# EAGLE design untitled (EAGLE 7.4.0)
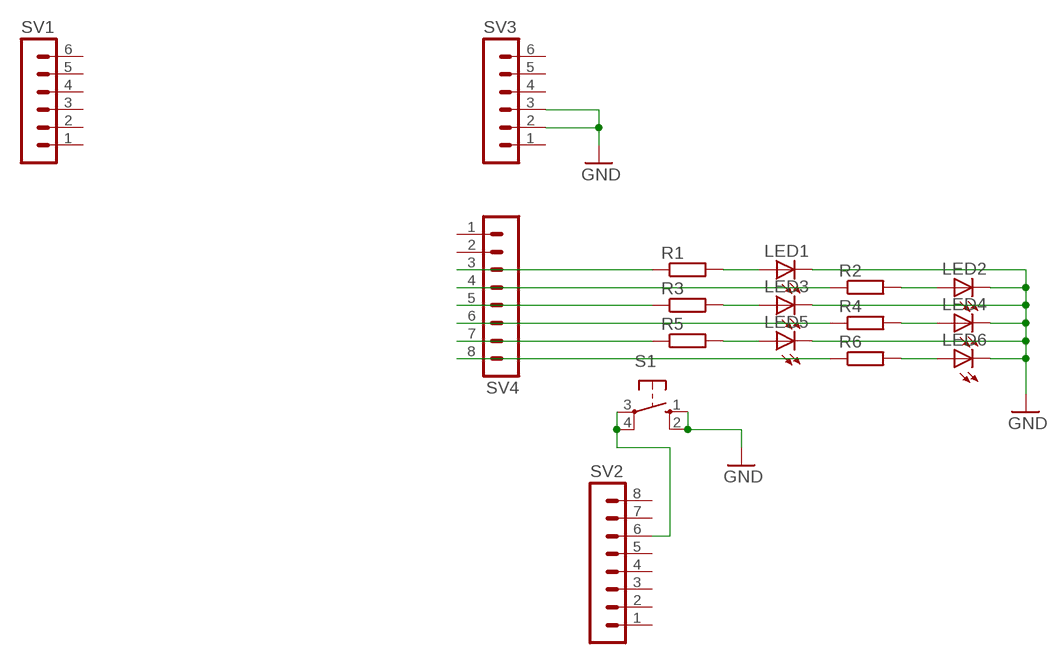
[diagram p0: schematic, sheet 1]

## Parts
LED1  LED3MM  [LED3MM]
LED2  LED3MM  [LED3MM]
LED3  LED3MM  [LED3MM]
LED4  LED3MM  [LED3MM]
LED5  LED3MM  [LED3MM]
LED6  LED3MM  [LED3MM]
R1  R-EU_0207/10  [0207/10]
R2  R-EU_0207/10  [0207/10]
R3  R-EU_0207/10  [0207/10]
R4  R-EU_0207/10  [0207/10]
R5  R-EU_0207/10  [0207/10]
R6  R-EU_0207/10  [0207/10]
S1  40-XX  [B3F-40XX]
SV1  MA06-1  [MA06-1]
SV2  MA08-1  [MA08-1]
SV3  MA06-1  [MA06-1]
SV4  MA08-1  [MA08-1]

## Nets
GND: LED1.K(C) LED2.K(C) LED3.K(C) LED4.K(C) LED5.K(C) LED6.K(C) S1.1(S) S1.2(S1) SV3.2 SV3.3
N$1: R6.1 SV4.8
N$2: LED4.A R4.2
N$3: R5.1 SV4.7
N$4: LED2.A R2.2
N$5: LED3.A R3.2
N$6: R4.1 SV4.6
N$7: R3.1 SV4.5
N$8: LED1.A R1.2
N$9: LED5.A R5.2
N$10: R2.1 SV4.4
N$11: R1.1 SV4.3
N$12: LED6.A R6.2
N$13: S1.3(P) S1.4(P1) SV2.6
Unconnected: SV1.1 SV1.2 SV1.3 SV1.4 SV1.5 SV1.6 SV2.1 SV2.2 SV2.3 SV2.4 SV2.5 SV2.7 SV2.8 SV3.1 SV3.4 SV3.5 SV3.6 SV4.1 SV4.2

## Library data of the parts
LED1-LED6 = led:LED: LED OSRAM: - CHIPLED LG R971, LG N971, LY N971, LG Q971, LY Q971, LO R971, LY R971 LH N974, LH R974 LS Q976, LO Q976, LY Q976 LO Q996 - Hyper CHIPLED LW Q18S LB Q993, LB Q99A, LB R99A - SideLED LS A670, LO A670, LY A670, LG A670, LP A670 LB A673, LV A673, LT A673, LW A673 LH A674 LY A675 LS A676, LA A676, LO A676, LY A676, LW A676 LS A679, LY A679, LG A679 - Hyper Micro SIDELED® LS Y876, LA Y876, LO Y876, LY Y876 LT Y87S - SmartLED LW L88C, LW L88S LB L89C, LB L89S, LG L890 LS L89K, LO L89K, LY L89K LS L896, LA L896, LO L896, LY L896 - TOPLED LS T670, LO T670, LY T670, LG T670, LP T670 LSG T670, LSP T670, LSY T670, LOP T670, LYG T670 LG T671, LOG T671, LSG T671 LB T673, LV T673, LT T673, LW T673 LH T674 LS T676, LA T676, LO T676, LY T676, LB T676, LH T676, LSB T676, LW T676 LB T67C, LV T67C, LT T67C, LS T67K, LO T67K, LY T67K, LW E67C LS E67B, LA E67B, LO E67B, LY E67B, LB E67C, LV E67C, LT E67C LW T67C LS T679, LY T679, LG T679 LS T770, LO T770, LY T770, LG T770, LP T770 LB T773, LV T773, LT T773, LW T773 LH T774 LS E675, LA E675, LY E675, LS T675 LS T776, LA T776, LO T776, LY T776, LB T776 LHGB T686 LT T68C, LB T68C - Hyper Mini TOPLED® LB M676 - Mini TOPLED Santana® LG M470 LS M47K, LO M47K, LY M47K Source: http://www.osram.convergy.de LUXEON: - LUMILED® LXK2-PW12-R00, LXK2-PW12-S00, LXK2-PW14-U00, LXK2-PW14-V00 LXK2-PM12-R00, LXK2-PM12-S00, LXK2-PM14-U00 LXK2-PE12-Q00, LXK2-PE12-R00, LXK2-PE12-S00, LXK2-PE14-T00, LXK2-PE14-U00 LXK2-PB12-K00, LXK2-PB12-L00, LXK2-PB12-M00, LXK2-PB14-N00, LXK2-PB14-P00, LXK2-PB14-Q00 LXK2-PR12-L00, LXK2-PR12-M00, LXK2-PR14-Q00, LXK2-PR14-R00 LXK2-PD12-Q00, LXK2-PD12-R00, LXK2-PD12-S00 LXK2-PH12-R00, LXK2-PH12-S00 LXK2-PL12-P00, LXK2-PL12-Q00, LXK2-PL12-R00 Source: www.luxeon.com KINGBRIGHT: KA-3528ASYC Source: www.kingbright.com
R1-R6 = resistor:R-EU_: RESISTOR, European symbol
S1 = switch-omron:40-XX: OMRON SWITCH; MF: OMRON COMPONENTS USA; MPN: B3F-4000; OC_FARNELL: 176434; OC_NEWARK: 36K3105
SV1 SV3 = con-lstb:MA06-1: PIN HEADER; OC_FARNELL: unknown; OC_NEWARK: unknown
SV2 SV4 = con-lstb:MA08-1: PIN HEADER; OC_FARNELL: unknown; OC_NEWARK: unknown

## Board
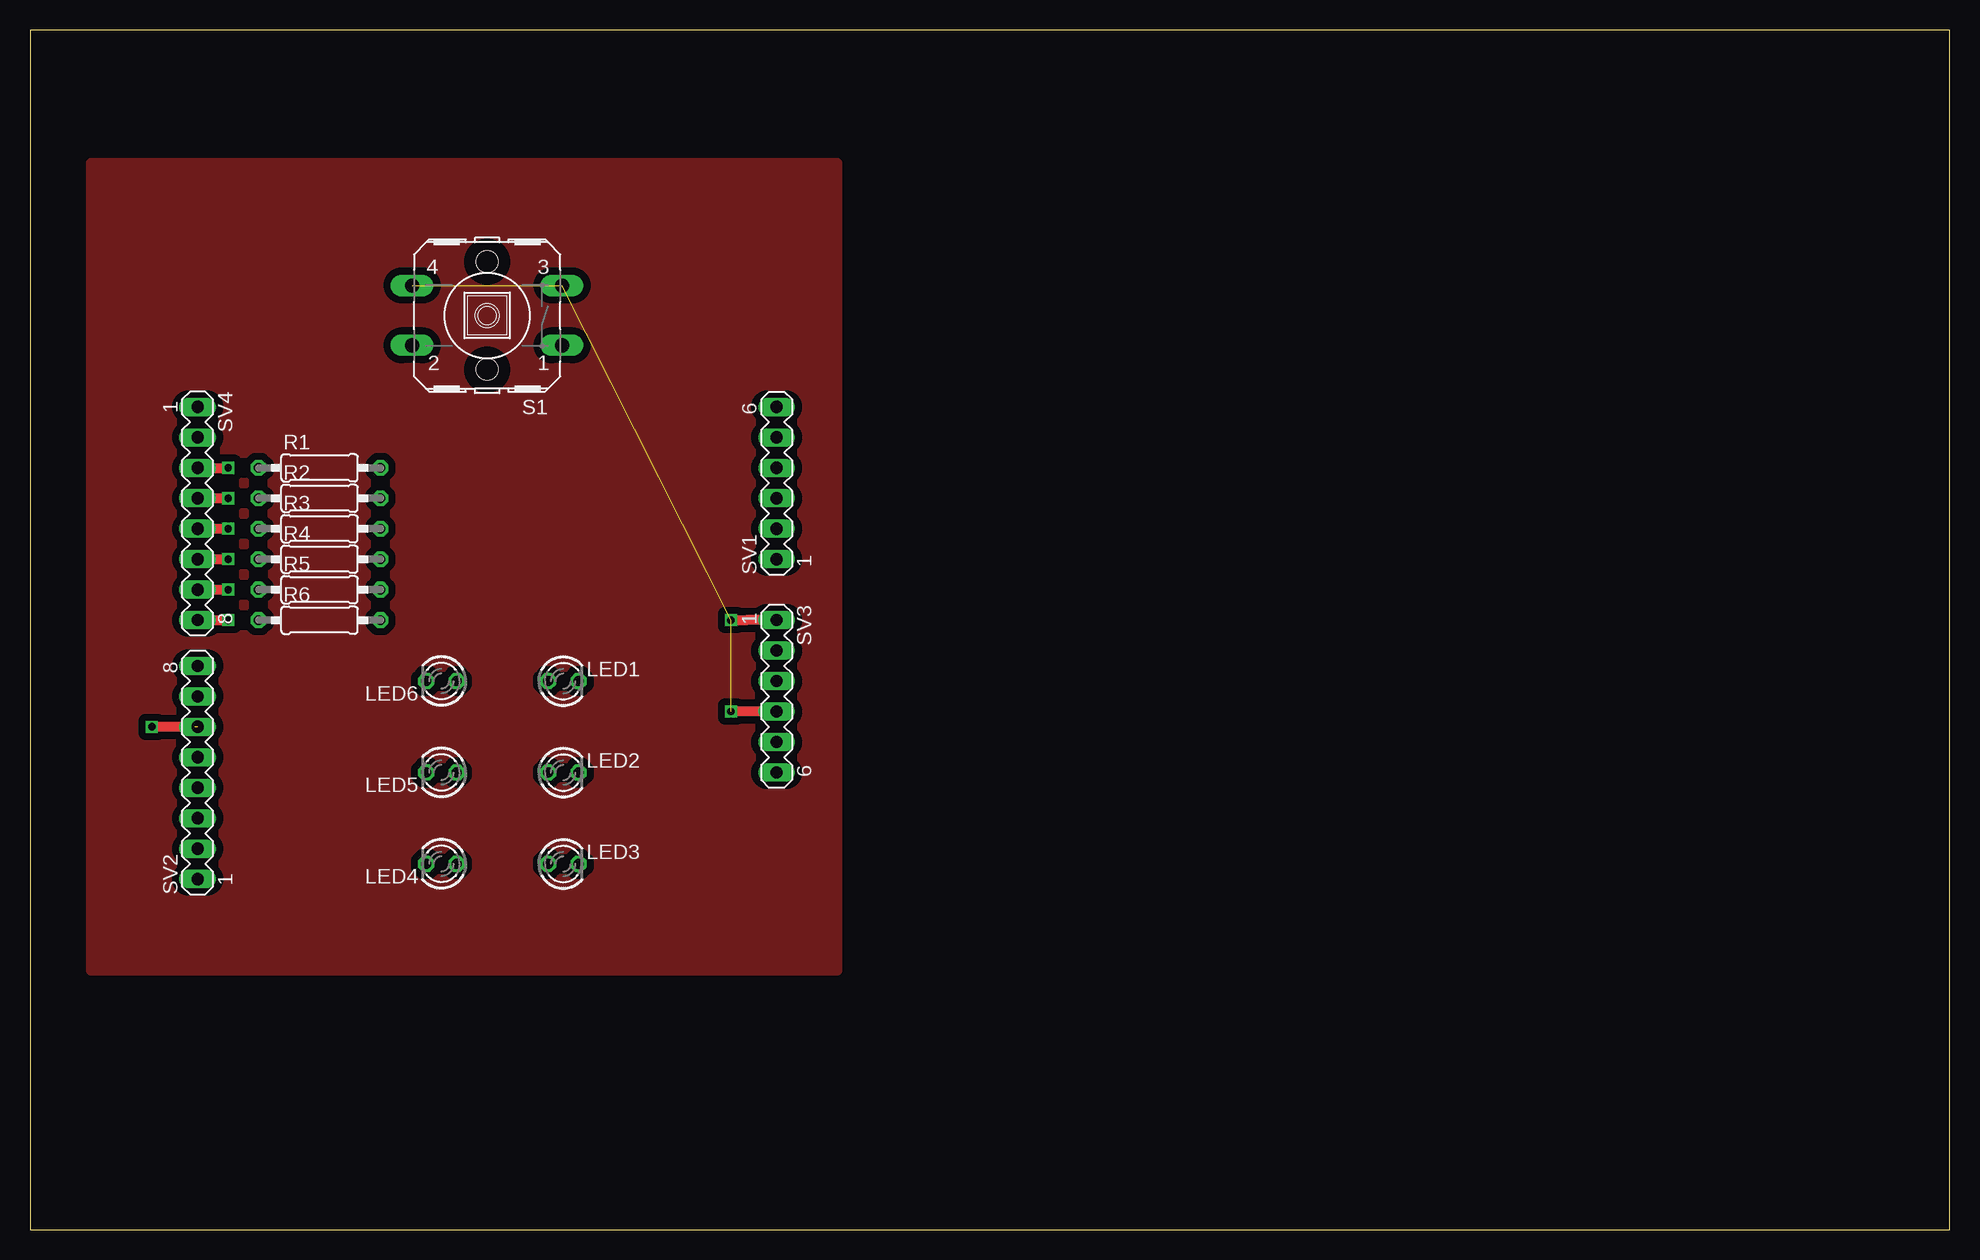
[diagram p1: board, top side]
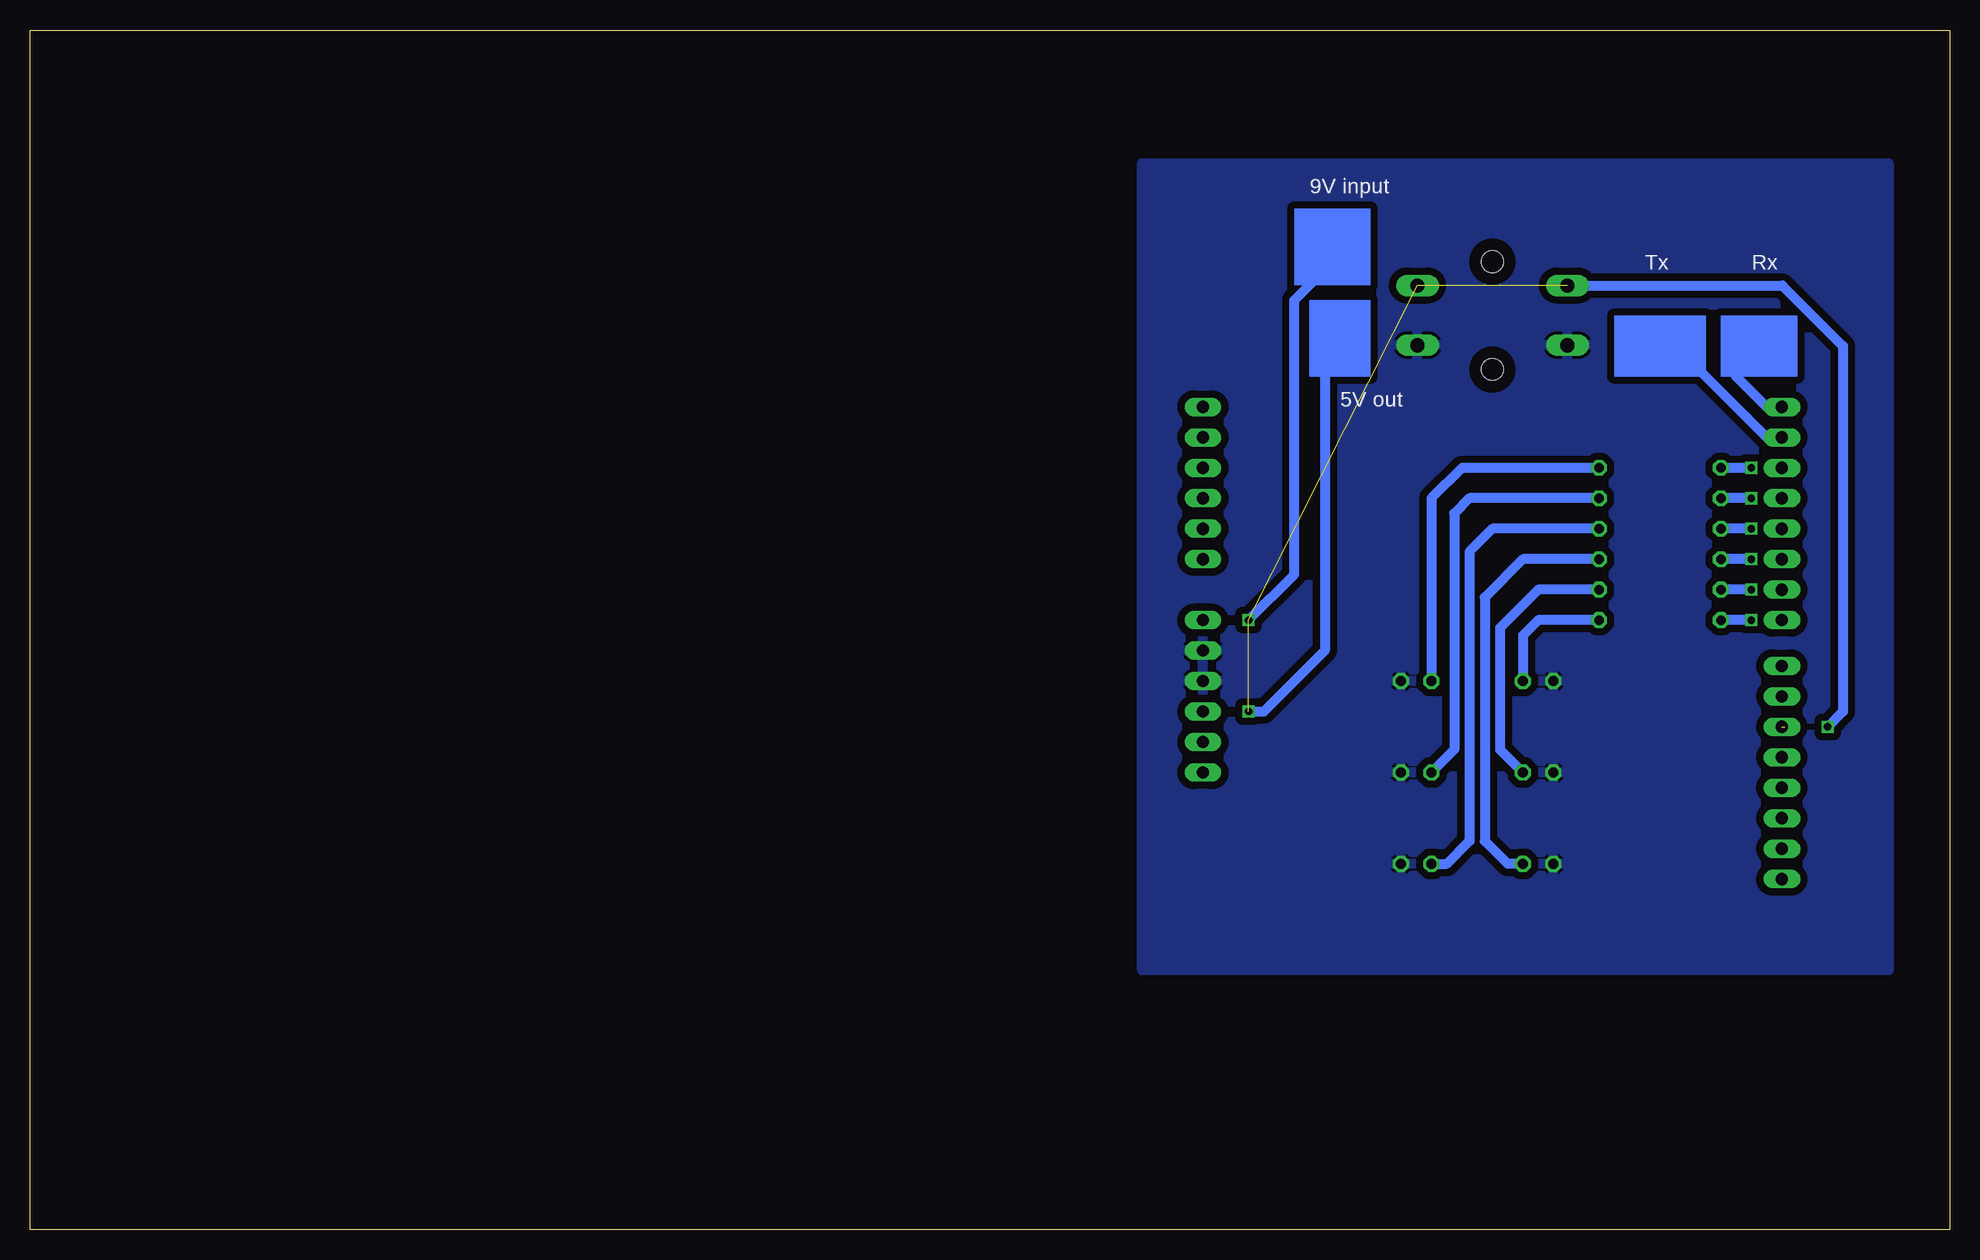
[diagram p2: board, bottom side, seen from below]

Size 160 x 100 mm. Coordinates in mm from the lower left corner, seen from the top.
Outline: 0,0 160,0 160,100 0,100 0,0
Copper layers (1*16): Top 0.035mm / dielectric 1.5mm / Bottom 0.035mm
Design rules "default": minimum track width 10mil, minimum drill 24mil, track to track 8mil, track to pad 8mil, pad to pad 8mil, via to via 8mil, smd to smd 8mil, copper to edge 40mil, drill to drill 8mil, minimum pad ring 10mil, minimum via ring 8mil, stop-mask expansion 4mil, vias tented up to drill 0mil, thermal gap 10mil

### Footprints (pad centres in the part's own frame; a part is rotated, then mirrored left to right if it is on the bottom)
LED3MM = drill 0.813 octagon: A -1.27,0; K 1.27,0
0207/10 = drill 0.813 octagon: 1 -5.08,0; 2 5.08,0
B3F-40XX = drill 1.194 long: 1 -6.248,2.489; 2 6.248,2.489; 3 -6.248,-2.489; 4 6.248,-2.489 | hole 1.803: 0,-4.496; 0,4.496
MA06-1 = drill 1.016 long: 1 -6.35,0; 2 -3.81,0; 3 -1.27,0; 4 1.27,0; 5 3.81,0; 6 6.35,0
MA08-1 = drill 1.016 long: 1 -8.89,0; 2 -6.35,0; 3 -3.81,0; 4 -1.27,0; 5 1.27,0; 6 3.81,0; 7 6.35,0; 8 8.89,0

### Placement (x,y rotation side)
LED1  44.45,45.72 0 top
LED2  44.45,38.1 0 top
LED3  44.45,30.48 0 top
LED4  34.29,30.48 180 top
LED5  34.29,38.1 180 top
LED6  34.29,45.72 180 top
R1  24.13,63.5 0 top
R2  24.13,60.96 0 top
R3  24.13,58.42 0 top
R4  24.13,55.88 0 top
R5  24.13,53.34 0 top
R6  24.13,50.8 0 top
S1  38.1,76.2 180 top
SV1  62.23,62.23 90 top
SV2  13.97,38.1 90 top
SV3  62.23,44.45 270 top
SV4  13.97,59.69 270 top

### Tracks (layer width: path | path; a pad name or v marks a point on that pad's centre or on a via)
GND
  pour Bottom (isolate 0.61): 6.35,21.59 67.31,21.59 67.31,88.9 5.08,88.9 5.08,21.59
N$1  (via drill 0.6)
  Top 0.813: SV4.8 v16.51,50.8
  Bottom 0.813: v16.51,50.8 R6.1
N$2
  Bottom 0.813: R4.2 35.56,55.88 38.73,52.7 38.73,32.38 36.83,30.48 LED4.A
N$3  (via drill 0.6)
  Top 0.813: SV4.7 v16.51,53.34
  Bottom 0.813: v16.51,53.34 R5.1
N$4
  Bottom 0.813: R2.2 40.01,60.96 41.27,59.69 41.27,40.01 LED2.A
N$5
  Bottom 0.813: R3.2 38.1,58.42 40.01,56.52 40.01,32.38 41.91,30.48 LED3.A
N$6  (via drill 0.6)
  Top 0.813: SV4.6 v16.51,55.88
  Bottom 0.813: v16.51,55.88 R4.1
N$7  (via drill 0.6)
  Top 0.813: SV4.5 v16.51,58.42
  Bottom 0.813: v16.51,58.42 R3.1
N$8
  Bottom 0.813: R1.2 40.64,63.5 43.18,60.96 LED1.A
N$9
  Bottom 0.813: R5.2 34.29,53.34 37.47,50.16 37.47,40.01 LED5.A
N$10  (via drill 0.6)
  Top 0.813: SV4.4 v16.51,60.96
  Bottom 0.813: v16.51,60.96 R2.1
N$11  (via drill 0.6)
  Top 0.813: SV4.3 v16.51,63.5
  Bottom 0.813: v16.51,63.5 R1.1
N$12
  Bottom 0.813: R6.2 34.29,50.8 35.56,49.53 LED6.A
N$13  (via drill 0.6)  (4 unrouted)
  Top 0.813: 13.72,41.91 v10.16,41.91
  Bottom 0.813: S1.4 13.92,78.69 8.89,73.66 8.89,43.18 v10.16,41.91
  other vias: 58.42,50.8 58.42,43.18
N$14
  Bottom 0.813: 15.24,68.58 17.78,71.12 17.78,72.39
N$15
  Bottom 0.813: 15.24,66.04 21.59,72.39
N$16  (via drill 0.6)
  Top 0.813: 60.96,43.18 v58.42,43.18
  Bottom 0.813: 52.07,71.12 52.07,48.26 57.15,43.18 v58.42,43.18
N$17  (via drill 0.6)
  Top 0.813: v58.42,50.8 59.69,50.8 60.96,50.8
  Bottom 0.813: 52.07,80.01 54.61,77.47 54.61,54.61 v58.42,50.8
N$18
  pour Top (isolate 0.61): 5.08,88.9 5.08,21.59 67.31,21.59 67.31,88.9
(copper drawn outside any net)
  shapes: Bottom area x5

### Text on the board
bNames: 9V input | Rx | Tx | 5V out